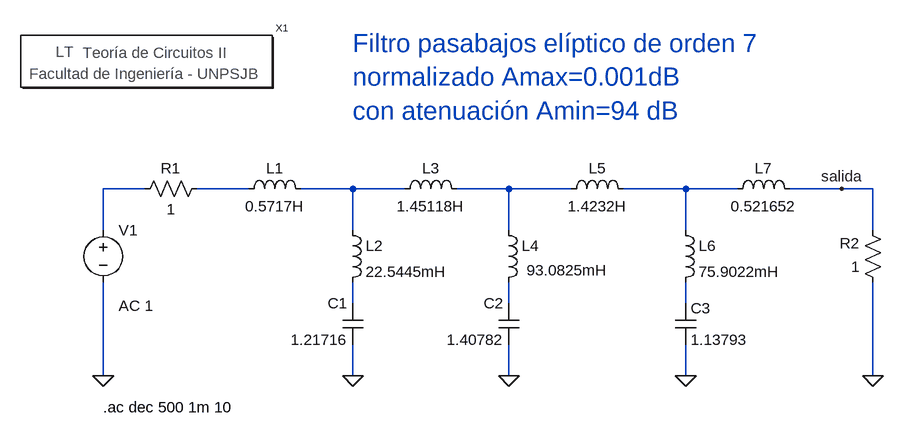
[diagram p0: schematic Filtro eliptico pasabajos de 7 orden normalizado.asc]
Filtro eliptico pasabajos de 7 orden normalizado.asc, the LTspice schematic file:
Version 4
SHEET 1 1296 680
WIRE -256 176 -320 176
WIRE -96 176 -176 176
WIRE 64 176 -16 176
WIRE 144 176 64 176
WIRE 304 176 224 176
WIRE 400 176 304 176
WIRE 576 176 480 176
WIRE 656 176 576 176
WIRE 816 176 736 176
WIRE 864 176 816 176
WIRE -320 240 -320 176
WIRE 64 240 64 176
WIRE 304 240 304 176
WIRE 576 240 576 176
WIRE 864 240 864 176
WIRE 64 352 64 320
WIRE 304 352 304 320
WIRE 576 352 576 320
WIRE -320 464 -320 320
WIRE 64 464 64 416
WIRE 304 464 304 416
WIRE 576 464 576 416
WIRE 864 464 864 320
FLAG 64 464 0
FLAG 304 464 0
FLAG 576 464 0
FLAG 864 464 0
FLAG -320 464 0
FLAG 816 176 salida
SYMBOL voltage -320 224 R0
WINDOW 123 24 132 Left 2
WINDOW 39 0 0 Left 2
SYMATTR Value2 AC 1
SYMATTR InstName V1
SYMATTR Value ""
SYMBOL cap 80 416 R180
WINDOW 0 24 64 Left 2
WINDOW 3 24 8 Left 2
SYMATTR InstName C1
SYMATTR Value 1.21716
SYMBOL cap 320 416 R180
WINDOW 0 24 64 Left 2
WINDOW 3 24 8 Left 2
SYMATTR InstName C2
SYMATTR Value 1.40782
SYMBOL res -160 160 R90
WINDOW 0 0 56 VBottom 2
WINDOW 3 32 56 VTop 2
SYMATTR InstName R1
SYMATTR Value 1
SYMBOL res 880 336 R180
WINDOW 0 36 76 Left 2
WINDOW 3 36 40 Left 2
SYMATTR InstName R2
SYMATTR Value 1
SYMBOL Circuitos2sym\\Letreros\\Teoría\ de\ Circuitos\ II -256 -16 R0
SYMATTR InstName X1
SYMBOL cap 560 352 R0
SYMATTR InstName C3
SYMATTR Value 1.13793
SYMBOL ind -112 192 R270
WINDOW 0 32 56 VTop 2
WINDOW 3 5 56 VBottom 2
SYMATTR InstName L1
SYMATTR Value 0.5717H
SYMBOL ind 48 224 R0
SYMATTR InstName L2
SYMATTR Value 22.5445mH
SYMBOL ind 128 192 R270
WINDOW 0 32 56 VTop 2
WINDOW 3 5 56 VBottom 2
SYMATTR InstName L3
SYMATTR Value 1.45118H
SYMBOL ind 288 224 R0
WINDOW 3 43 77 Left 2
SYMATTR InstName L4
SYMATTR Value 93.0825mH
SYMBOL ind 384 192 R270
WINDOW 0 32 56 VTop 2
WINDOW 3 5 56 VBottom 2
SYMATTR InstName L5
SYMATTR Value 1.4232H
SYMBOL ind 560 224 R0
SYMATTR InstName L6
SYMATTR Value 75.9022mH
SYMBOL ind 640 192 R270
WINDOW 0 32 56 VTop 2
WINDOW 3 5 56 VBottom 2
SYMATTR InstName L7
SYMATTR Value 0.521652
TEXT 64 -48 Left 4 ;Filtro pasabajos elíptico de orden 7 \nnormalizado Amax=0.001dB\ncon atenuación Amin=94 dB
TEXT -320 512 Left 2 !.ac dec 500 1m 10

The netlist it stands for:
* Filtro eliptico pasabajos de 7 orden normalizado.asc
V1 N001 0 AC 1
C1 0 N006 1.21716
C2 0 N007 1.40782
R1 N002 N001 1
R2 0 salida 1
XX1 Teoría de Circuitos II
C3 N008 0 1.13793
L1 N002 N003 0.5717H
L2 N003 N006 22.5445mH
L3 N003 N004 1.45118H
L4 N004 N007 93.0825mH
L5 N004 N005 1.4232H
L6 N005 N008 75.9022mH
L7 N005 salida 0.521652
* Filtro pasabajos elíptico de orden 7
* normalizado Amax=0.001dB
* con atenuación Amin=94 dB
.ac dec 500 1m 10
.backanno
.end